# EAGLE schematic DRUM_MACHINE_SCHEMATIC (EAGLE 8.0.0)
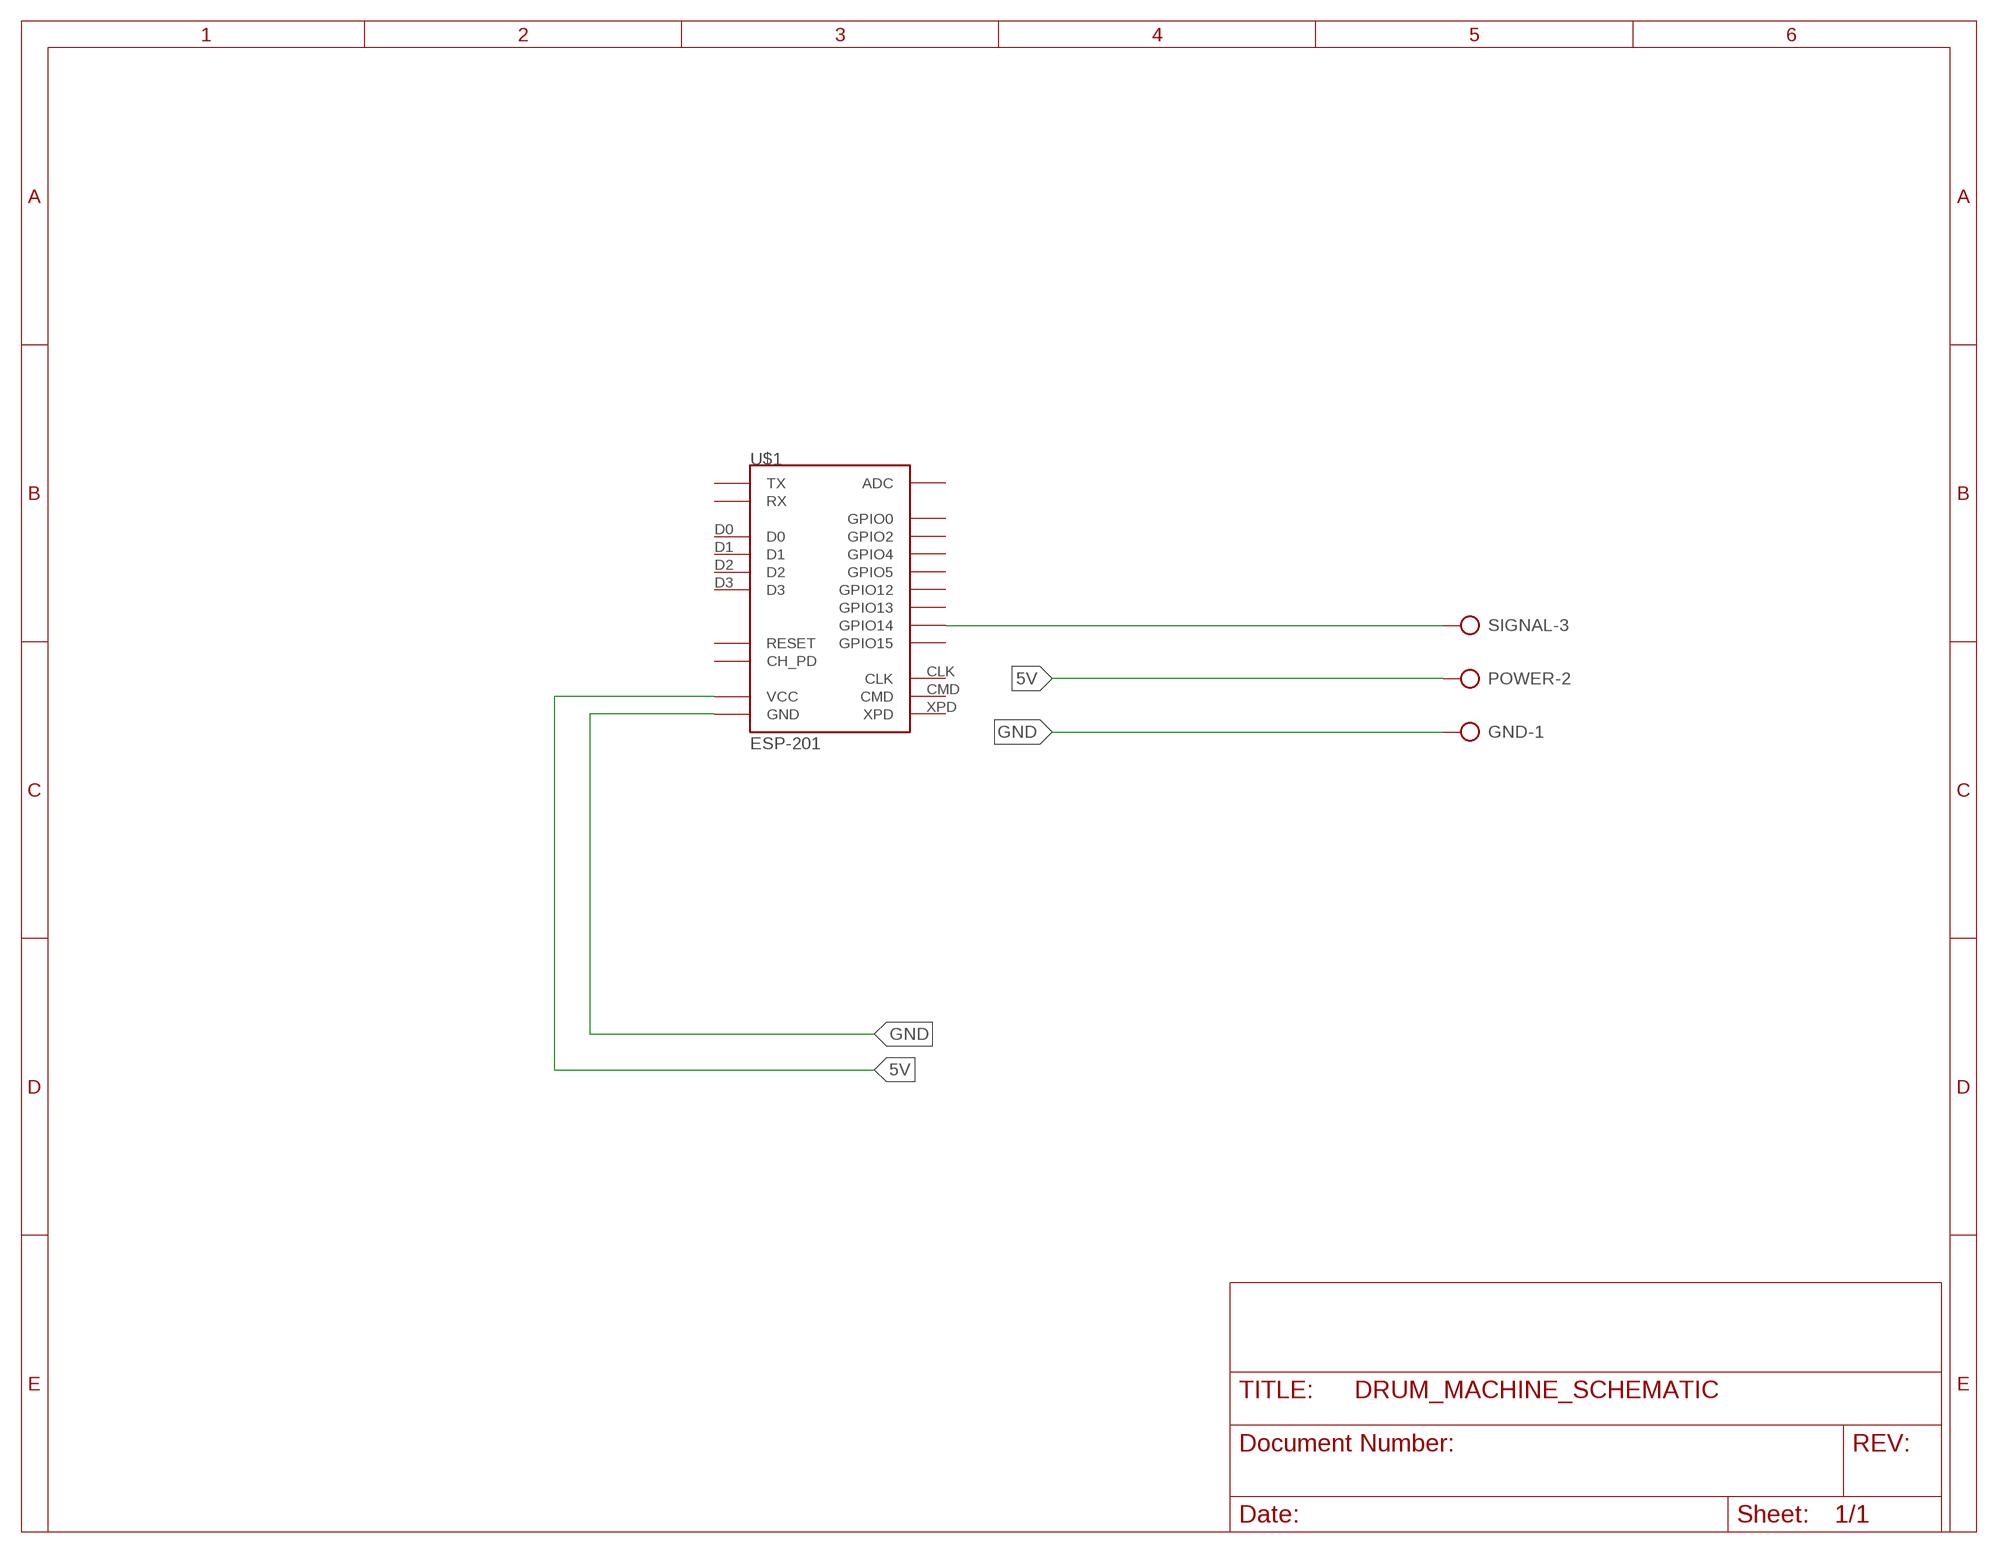
[diagram p0: schematic, sheet 1]

## Parts
GND  AK300/2  [AK300/2]
POWER  AK300/2  [AK300/2]
SIGNAL  AK300/3  [AK300/3]
U$1  ESP-201  [ESP-201]

## Nets
5V: POWER.2 U$1.3V3(VCC) U$1.3V3_2(VCC) U$1.3V3_3(VCC)
GND: GND.1 U$1.GND U$1.GND_2(GND) U$1.GND_3(GND)
SIGNAL: SIGNAL.3 U$1.GPIO14
Unconnected: GND.2 POWER.1 SIGNAL.1 SIGNAL.2 U$1.ADC U$1.CH_PD U$1.CLK U$1.CMD U$1.D0 U$1.D1 U$1.D2 U$1.D3 U$1.GPIO0 U$1.GPIO2 U$1.GPIO4 U$1.GPIO5 U$1.GPIO12 U$1.GPIO13 U$1.GPIO15 U$1.RST(RESET) U$1.RX U$1.TX U$1.XPD

## Library data of the parts
GND POWER = con-ptr500:AK300/2: CONNECTOR; OC_FARNELL: unknown; OC_NEWARK: unknown
SIGNAL = con-ptr500:AK300/3: CONNECTOR; OC_FARNELL: unknown; OC_NEWARK: unknown
U$1 = esp8266modules:ESP-201: ESP8266 Wifi Module ESP-201; DIMENSIONS: 25 x 35 mm; PINS: 26; PITCH: 0.1" / 2.54 mm